# EAGLE design wemos D1 (EAGLE 6.5.0)
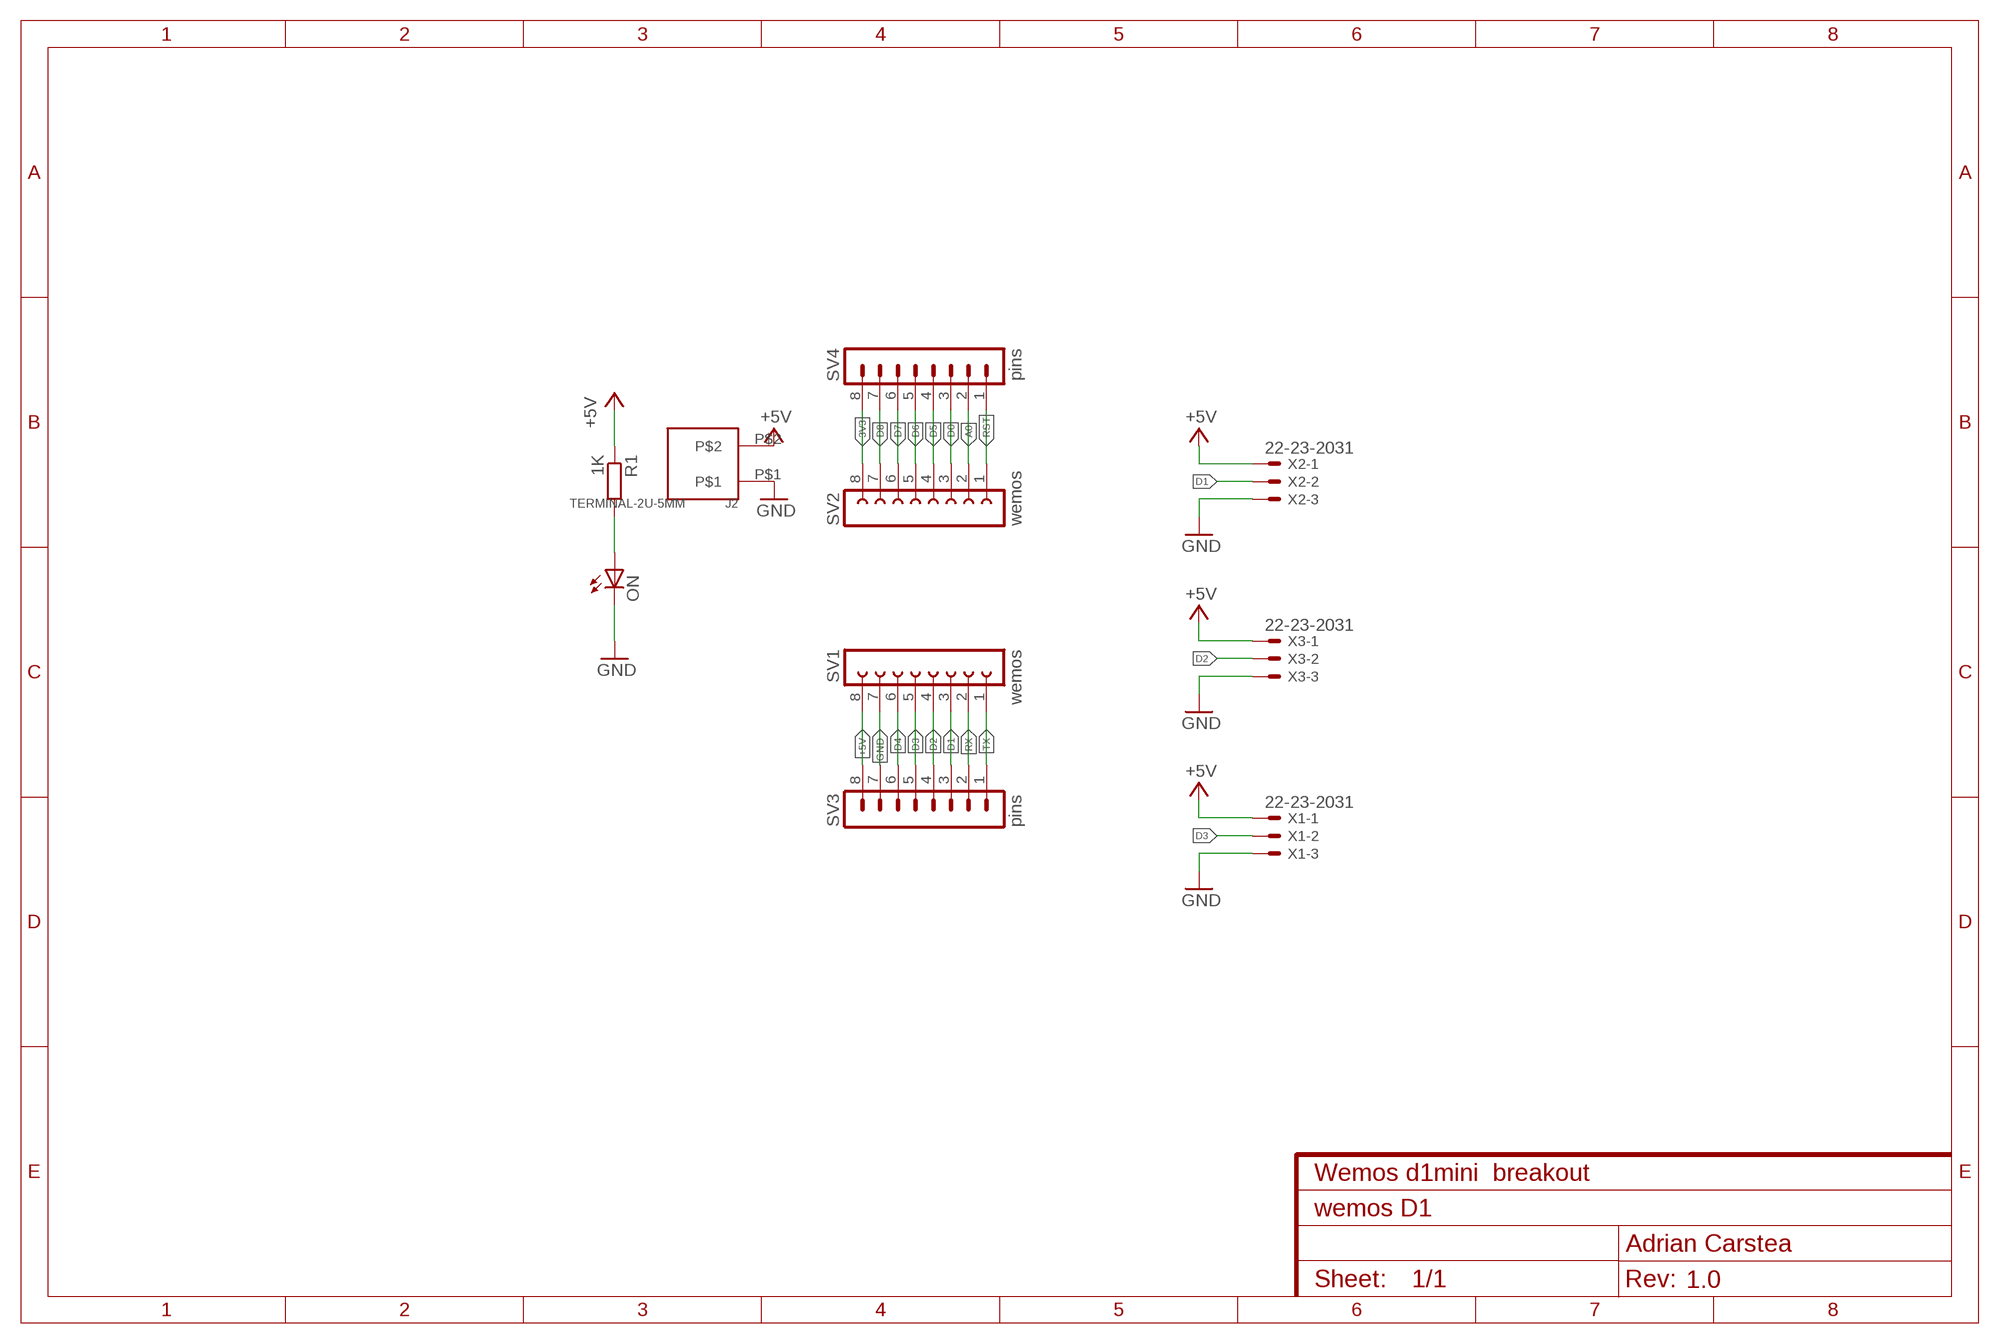
[diagram p0: schematic, sheet 1]
FRAME1 (FRAME-A4L): CNAME: Wemos d1mini breakout; CREVISION: 1.0; DESIGNER: Adrian Carstea

## Parts
1K  R1  R-EU_R0805  [R0805]
J2  TERMINAL-2U-5MM  [TERMINAL-2U-5MM]
ON  LEDSML0805  [SML0805]
SV1  wemos  FE08-1  [FE08]
SV2  wemos  FE08-1  [FE08]
SV3  pins  MA08-1  [MA08-1]
SV4  pins  MA08-1  [MA08-1]
X1  22-23-2031  [22-23-2031]
X2  22-23-2031  [22-23-2031]
X3  22-23-2031  [22-23-2031]

## Nets
3V3: SV2.8 SV4.8
+5V: 1K.1 J2.P$2 SV1.8 SV3.8 X1.1 X2.1 X3.1
A0: SV2.2 SV4.2
D0: SV2.3 SV4.3
D1: SV1.3 SV3.3 X2.2
D2: SV1.4 SV3.4 X3.2
D3: SV1.5 SV3.5 X1.2
D4: SV1.6 SV3.6
D5: SV2.4 SV4.4
D6: SV2.5 SV4.5
D7: SV2.6 SV4.6
D8: SV2.7 SV4.7
GND: J2.P$1 ON.C SV1.7 SV3.7 X1.3 X2.3 X3.3
N$1: 1K.2 ON.A
RST: SV2.1 SV4.1
RX: SV1.2 SV3.2
TX: SV1.1 SV3.1

## Library data of the parts
1K = resistor:R-EU_: RESISTOR, European symbol
J2 = Itead_BP_110825.lbr:TERMINAL-2U-5MM: CON001
ON = led:LED: LED OSRAM: - CHIPLED LG R971, LG N971, LY N971, LG Q971, LY Q971, LO R971, LY R971 LH N974, LH R974 LS Q976, LO Q976, LY Q976 LO Q996 - Hyper CHIPLED LW Q18S LB Q993, LB Q99A, LB R99A - SideLED LS A670, LO A670, LY A670, LG A670, LP A670 LB A673, LV A673, LT A673, LW A673 LH A674 LY A675 LS A676, LA A676, LO A676, LY A676, LW A676 LS A679, LY A679, LG A679 - Hyper Micro SIDELED® LS Y876, LA Y876, LO Y876, LY Y876 LT Y87S - SmartLED LW L88C, LW L88S LB L89C, LB L89S, LG L890 LS L89K, LO L89K, LY L89K LS L896, LA L896, LO L896, LY L896 - TOPLED LS T670, LO T670, LY T670, LG T670, LP T670 LSG T670, LSP T670, LSY T670, LOP T670, LYG T670 LG T671, LOG T671, LSG T671 LB T673, LV T673, LT T673, LW T673 LH T674 LS T676, LA T676, LO T676, LY T676, LB T676, LH T676, LSB T676, LW T676 LB T67C, LV T67C, LT T67C, LS T67K, LO T67K, LY T67K, LW E67C LS E67B, LA E67B, LO E67B, LY E67B, LB E67C, LV E67C, LT E67C LW T67C LS T679, LY T679, LG T679 LS T770, LO T770, LY T770, LG T770, LP T770 LB T773, LV T773, LT T773, LW T773 LH T774 LS E675, LA E675, LY E675, LS T675 LS T776, LA T776, LO T776, LY T776, LB T776 LHGB T686 LT T68C, LB T68C - Hyper Mini TOPLED® LB M676 - Mini TOPLED Santana® LG M470 LS M47K, LO M47K, LY M47K Source: http://www.osram.convergy.de LUXEON: - LUMILED® LXK2-PW12-R00, LXK2-PW12-S00, LXK2-PW14-U00, LXK2-PW14-V00 LXK2-PM12-R00, LXK2-PM12-S00, LXK2-PM14-U00 LXK2-PE12-Q00, LXK2-PE12-R00, LXK2-PE12-S00, LXK2-PE14-T00, LXK2-PE14-U00 LXK2-PB12-K00, LXK2-PB12-L00, LXK2-PB12-M00, LXK2-PB14-N00, LXK2-PB14-P00, LXK2-PB14-Q00 LXK2-PR12-L00, LXK2-PR12-M00, LXK2-PR14-Q00, LXK2-PR14-R00 LXK2-PD12-Q00, LXK2-PD12-R00, LXK2-PD12-S00 LXK2-PH12-R00, LXK2-PH12-S00 LXK2-PL12-P00, LXK2-PL12-Q00, LXK2-PL12-R00 Source: www.luxeon.com KINGBRIGHT: KA-3528ASYC Source: www.kingbright.com
SV1 SV2 = con-lsta:FE08-1: FEMALE HEADER; OC_FARNELL: unknown; OC_NEWARK: unknown
SV3 SV4 = con-lstb:MA08-1: PIN HEADER; OC_FARNELL: unknown; OC_NEWARK: unknown
X1-X3 = con-molex:22-23-2031: .100" (2.54mm) Center Header - 3 Pin; MF: MOLEX; MPN: 22-23-2031; OC_FARNELL: 1462950; OC_NEWARK: 30C0862

## Net classes
1 didi: width 0.008 mm

## Board
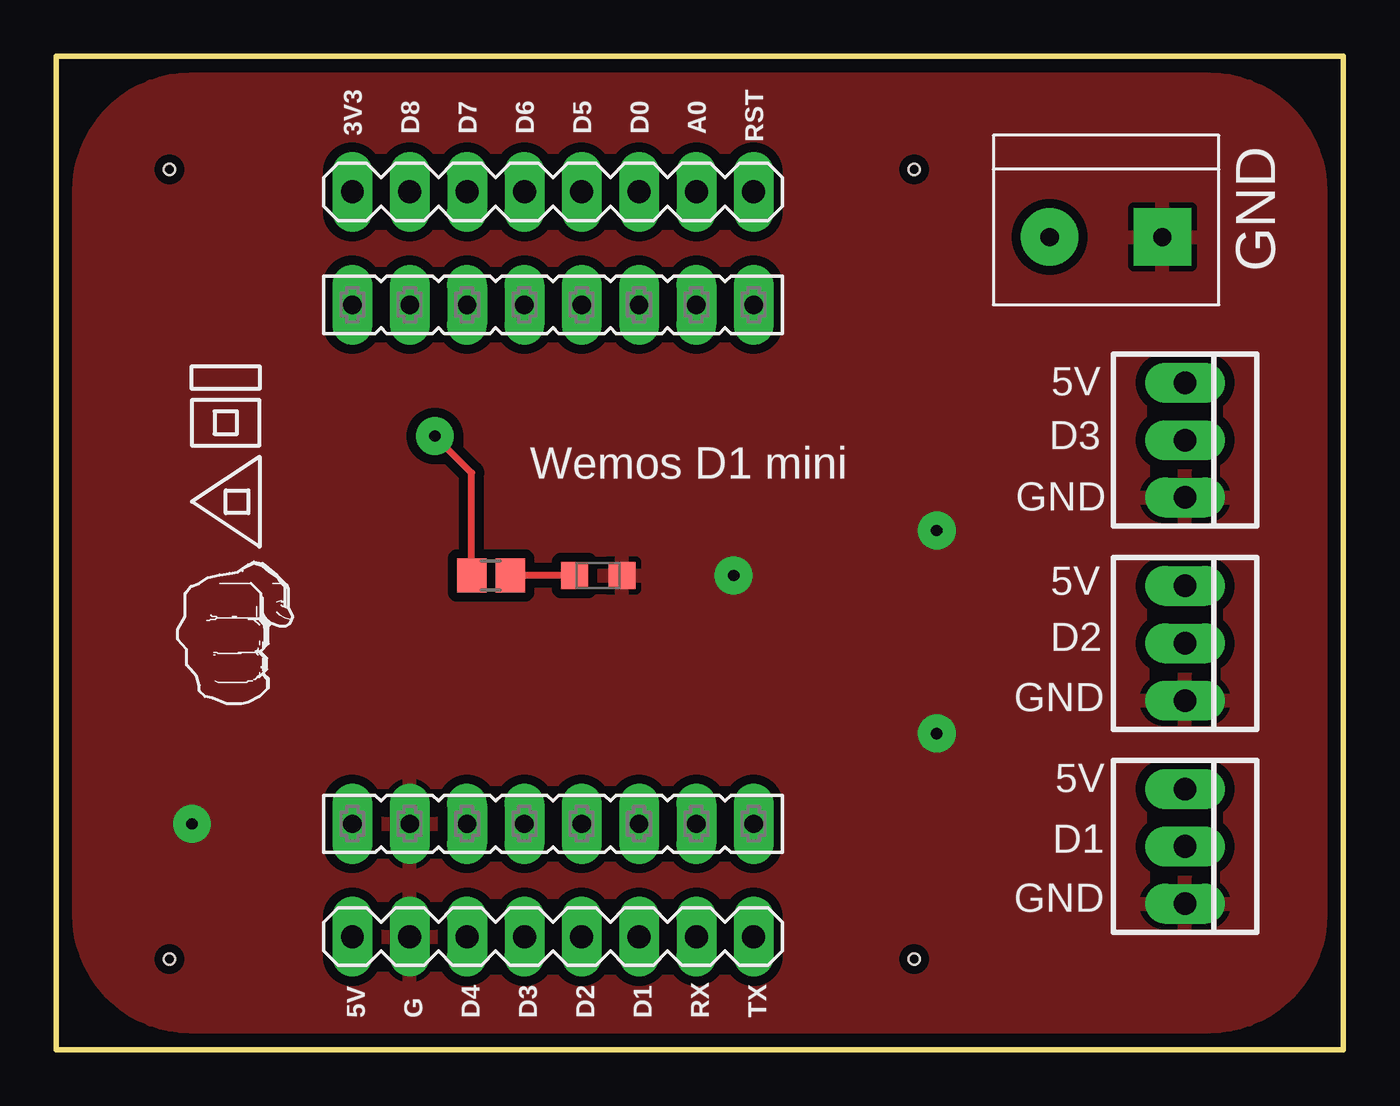
[diagram p1: board, top side]
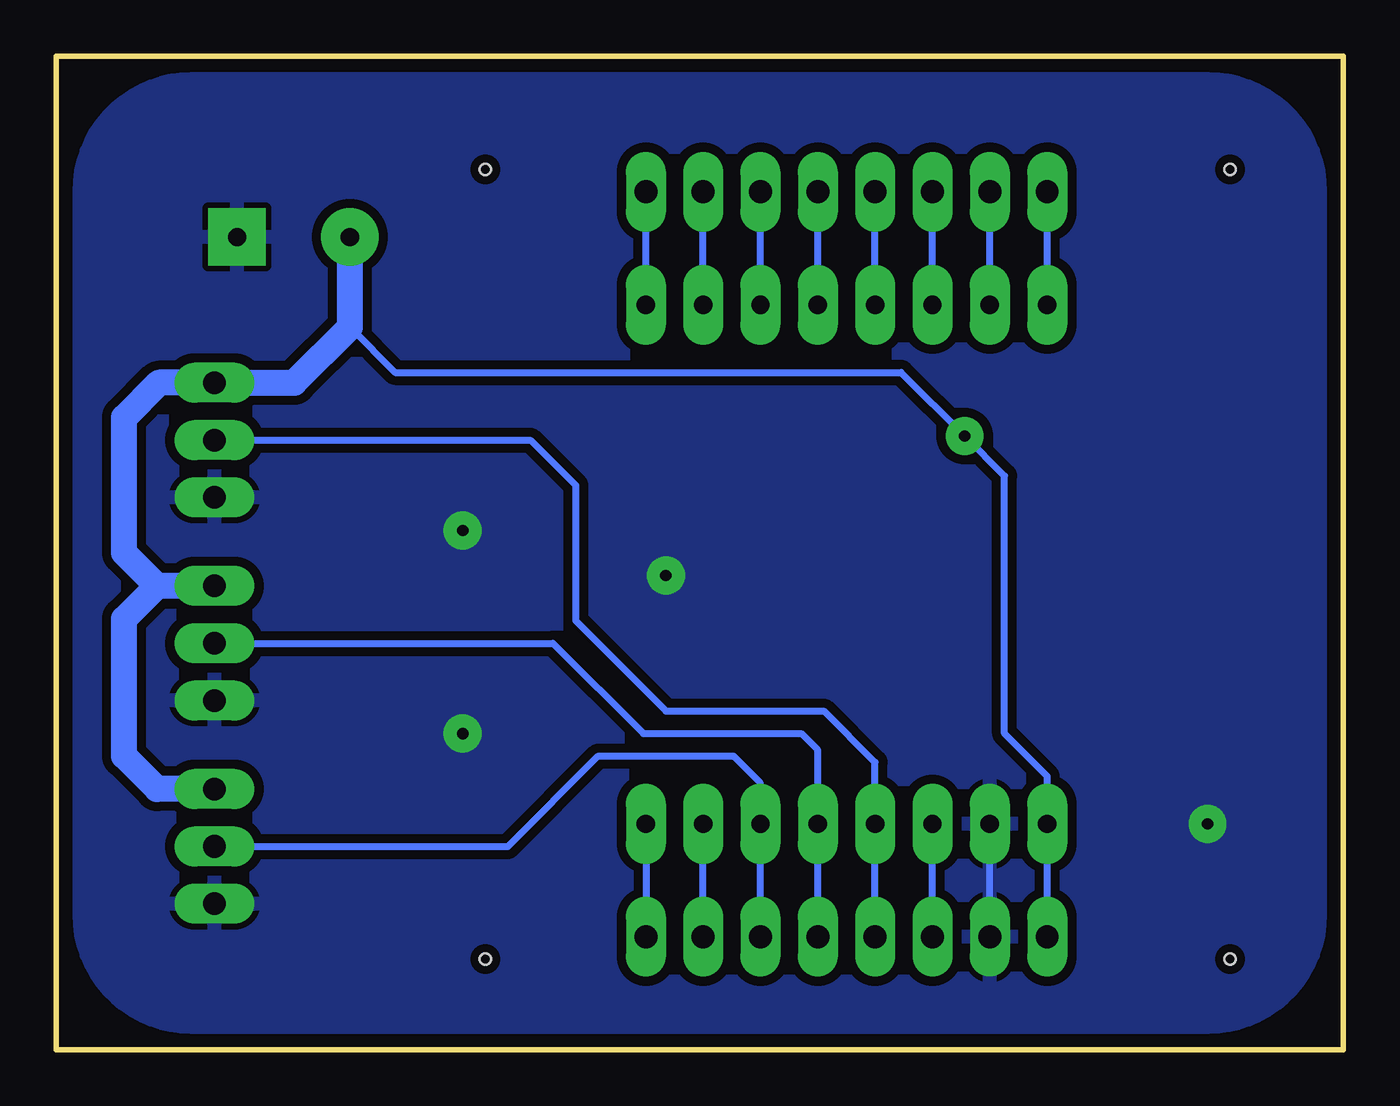
[diagram p2: board, bottom side, seen from below]

Size 57 x 44 mm. Coordinates in mm from the lower left corner, seen from the top.
Outline: 0,0 0,44 57,44 57,0 0,0
Copper layers (1*16): Top 0.0356mm / dielectric 1.5011mm / Bottom 0.0356mm
Design rules "oshpark-2layer": minimum track width 6mil, minimum drill 13mil, track to track 6mil, track to pad 6mil, pad to pad 6mil, via to via 6mil, smd to smd 6mil, copper to edge 15mil, drill to drill 6mil, minimum pad ring 7mil, minimum via ring 7mil, stop-mask expansion 2.5mil, vias tented up to drill 0mil, thermal gap 10mil
Holes 0.5 mm at 38,4 5,39 38,39 5,4

### Footprints (pad centres in the part's own frame; a part is rotated, then mirrored left to right if it is on the bottom)
R0805 = smd 1.3 x 1.5: 1 -0.85,0; 2 0.85,0
TERMINAL-2U-5MM = drill 0.8 pad 2.54 square: P$1 0,0 | drill 0.8 pad 2.54: P$2 5,0
SML0805 = smd 1.2 x 1.2: A 1.05,0; C -1.05,0
FE08 = drill 0.813 pad 1.778 long: 1 -8.89,0; 2 -6.35,0; 3 -3.81,0; 4 -1.27,0; 5 1.27,0; 6 3.81,0; 7 6.35,0; 8 8.89,0
MA08-1 = drill 1.016 pad 1.778 long: 1 -8.89,0; 2 -6.35,0; 3 -3.81,0; 4 -1.27,0; 5 1.27,0; 6 3.81,0; 7 6.35,0; 8 8.89,0
22-23-2031 = drill 1 pad 1.778 long: 1 -2.54,0; 2 0,0; 3 2.54,0

### Placement (x,y rotation side)
1K  19.25,21 0 top
J2  49,36 180 top
ON  24,21 180 top
SV1  22,10 180 top
SV2  22,33 180 top
SV3  22,5 180 top
SV4  22,38 180 top
U$1  [ADILOGO]  9,23 90 top
X1  50,27 270 top
X2  50,9 270 top
X3  50,18 270 top

### Tracks (layer width: path | path; a pad name or v marks a point on that pad's centre or on a via)
3V3
  Bottom 0.305: SV2.8 SV4.8
+5V  (via drill 0.5 pad 1.68)
  Top 0.305: 1K.1 18.4,25.54 v16.76,27.18
  Bottom 0.305: SV3.8 SV1.8 13.11,12.11 15,14 15,25.41 v16.76,27.18 19.59,30 42,30 44,32
  Bottom 1.143: J2.P$2 44,32 46.46,29.54 X1.1 52.46,29.54 54,28 54,22 52.54,20.54 | X3.1 52.54,20.54 | X2.1 52.54,11.54 54,13 54,19.08 52.54,20.54
A0
  Bottom 0.305: SV2.2 SV4.2
D0
  Bottom 0.305: SV2.3 SV4.3
D1
  Bottom 0.305: SV3.3 SV1.3 25.81,11.81 27,13 33,13 37,9 X2.2
D2
  Bottom 0.305: SV3.4 SV1.4 23.27,13.27 24,14 31,14 35,18 X3.2
D3
  Bottom 0.305: SV3.5 SV1.5 20.73,12.73 23,15 30,15 34,19 34,25 36,27 X1.2
D4
  Bottom 0.305: SV3.6 SV1.6
D5
  Bottom 0.305: SV2.4 SV4.4
D6
  Bottom 0.305: SV2.5 SV4.5
D7
  Bottom 0.305: SV2.6 SV4.6
D8
  Bottom 0.305: SV2.7 SV4.7
GND  (via drill 0.5 pad 1.68)
  Bottom 0.305: SV3.7 SV1.7
  other vias: 6,10 30,21 39,23 39,14
  pour Top (isolate 0.406): 6,1 arc-90 1,6 1,38 arc-90 6,43 51,43 arc-90 56,38 56,6 arc-90 51,1 30,1
  pour Bottom (isolate 0.406): 28,1 6,1 arc-90 1,6 1,38 arc-90 6,43 51,43 arc-90 56,38 56,6 arc-90 51,1
N$1
  Top 0.305: ON.A 1K.2
RST
  Bottom 0.305: SV2.1 SV4.1
RX
  Bottom 0.305: SV3.2 SV1.2
TX
  Bottom 0.305: SV1.1 SV3.1

### Text on the board
tPlace: 3V3 | RST | D8 | D7 | D6 | D5 | D0 | A0 | GND | 5V | D3 | Wemos D1 mini | GND | 5V | D2 | GND | 5V | D1 | GND | 5V | G | D4 | D3 | D2 | D1 | RX | TX